# Altium schematic sheet main.SchDoc
size 420 x 297 mm; DocumentNumber: 1; SheetNumber: 1; SheetTotal: 2
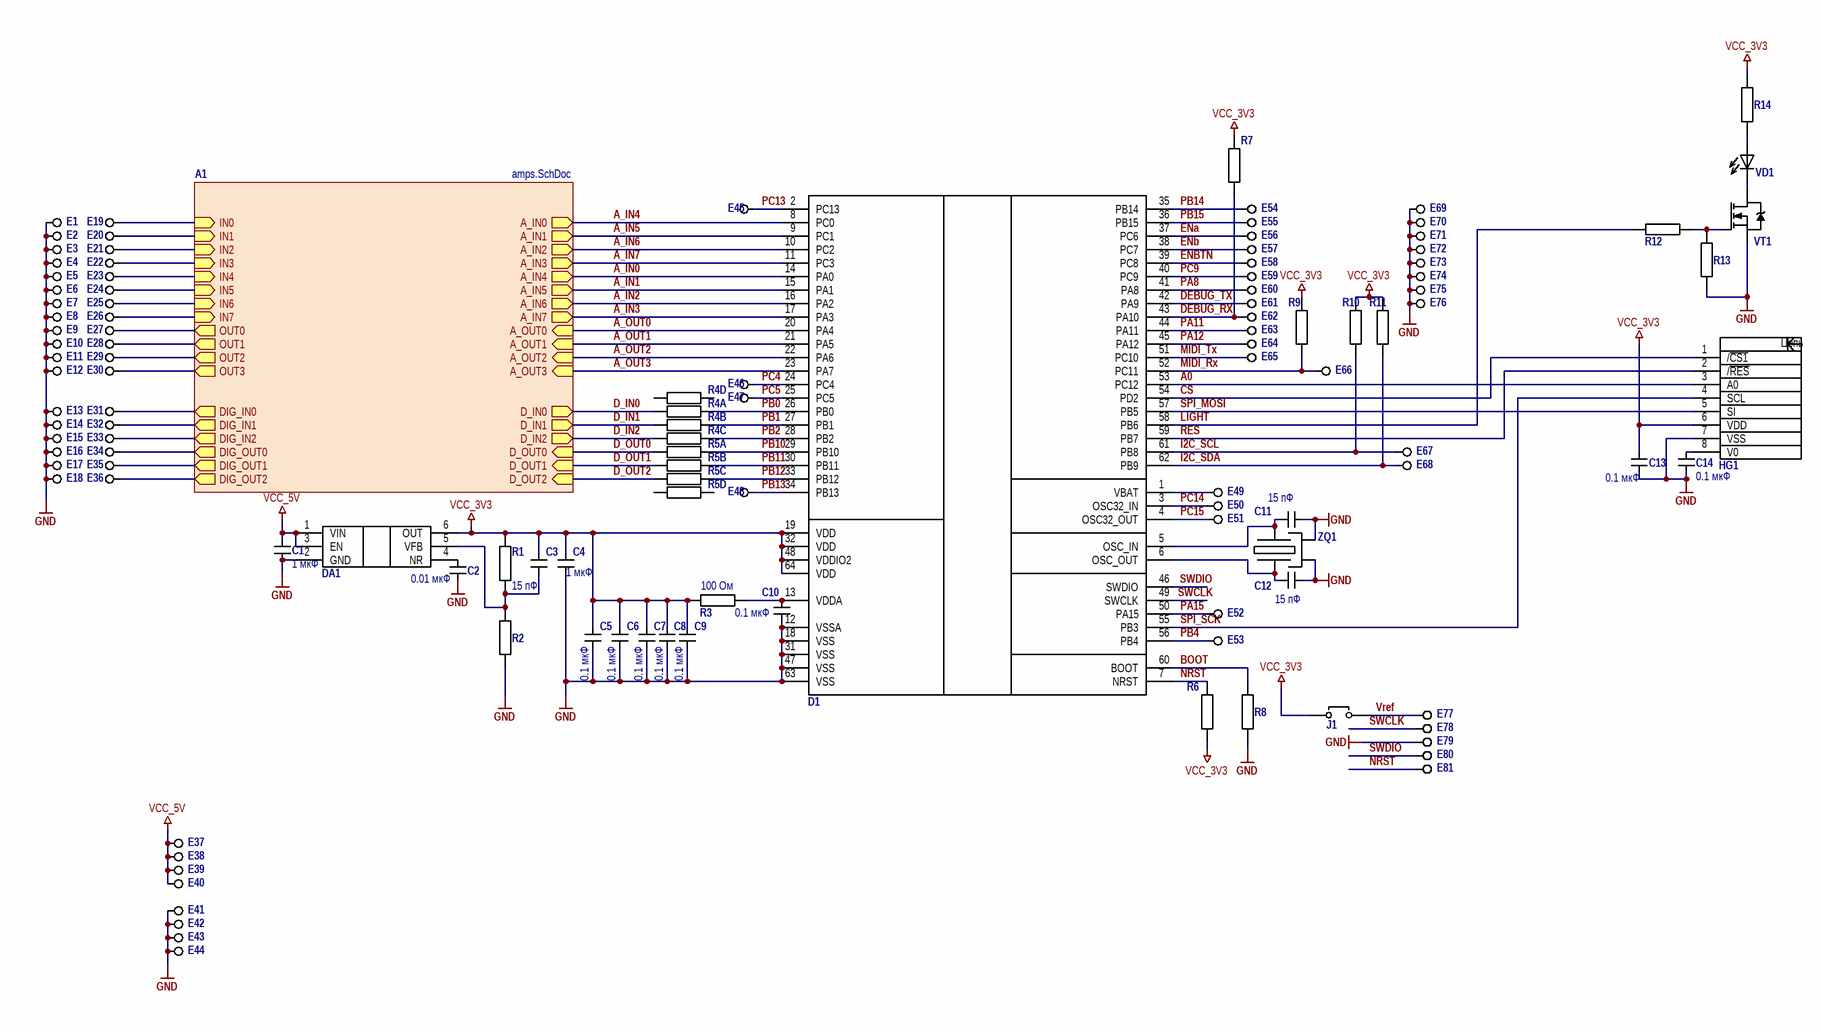
[diagram p0: main.SchDoc]

## Parts
C1  value 1 мкФ  [CAPC1608X08L]  (hidden comment: C0603_16v_1u)
C2  value 0.01 мкФ  [CAPC1608X08L]  (hidden comment: C0603_50v_0,01u)
C3  value 15 пФ  [CAPC1608X08L]  (hidden comment: C0603_50v_15p)
C4  value 1 мкФ  [CAPC1608X08L]  (hidden comment: C0603_16v_1u)
C5  value 0.1 мкФ  [CAPC1608X08L]  (hidden comment: C0603_50v_0,1u)
C6  value 0.1 мкФ  [CAPC1608X08L]  (hidden comment: C0603_50v_0,1u)
C7  value 0.1 мкФ  [CAPC1608X08L]  (hidden comment: C0603_50v_0,1u)
C8  value 0.1 мкФ  [CAPC1608X08L]  (hidden comment: C0603_50v_0,1u)
C9  value 0.1 мкФ  [CAPC1608X08L]  (hidden comment: C0603_50v_0,1u)
C10  value 0.1 мкФ  [CAPC1608X08L]  (hidden comment: C0603_50v_0,1u)
C11  value 15 пФ  [CAPC1608X08L]  (hidden comment: C0603_50v_15p)
C12  value 15 пФ  [CAPC1608X08L]  (hidden comment: C0603_50v_15p)
C13  value 0.1 мкФ  [CAPC1608X08L]  (hidden comment: C0603_50v_0,1u)
C14  value 0.1 мкФ  [CAPC1608X08L]  (hidden comment: C0603_50v_0,1u)
D1  STM32F091RB6  [TSQFP50P_10x10_64N]  (value not drawn)
DA1  TPS73001DBVT  [SOT95P280X145-6N]  (value not drawn)
E1  CON 0.9mm  [con_0.9mm]  (value not drawn)  (no BOM)
E2  CON 0.9mm  [con_0.9mm]  (value not drawn)  (no BOM)
E3  CON 0.9mm  [con_0.9mm]  (value not drawn)  (no BOM)
E4  CON 0.9mm  [con_0.9mm]  (value not drawn)  (no BOM)
E5  CON 0.9mm  [con_0.9mm]  (value not drawn)  (no BOM)
E6  CON 0.9mm  [con_0.9mm]  (value not drawn)  (no BOM)
E7  CON 0.9mm  [con_0.9mm]  (value not drawn)  (no BOM)
E8  CON 0.9mm  [con_0.9mm]  (value not drawn)  (no BOM)
E9  CON 0.9mm  [con_0.9mm]  (value not drawn)  (no BOM)
E10  CON 0.9mm  [con_0.9mm]  (value not drawn)  (no BOM)
E11  CON 0.9mm  [con_0.9mm]  (value not drawn)  (no BOM)
E12  CON 0.9mm  [con_0.9mm]  (value not drawn)  (no BOM)
E13  CON 0.9mm  [con_0.9mm]  (value not drawn)  (no BOM)
E14  CON 0.9mm  [con_0.9mm]  (value not drawn)  (no BOM)
E15  CON 0.9mm  [con_0.9mm]  (value not drawn)  (no BOM)
E16  CON 0.9mm  [con_0.9mm]  (value not drawn)  (no BOM)
E17  CON 0.9mm  [con_0.9mm]  (value not drawn)  (no BOM)
E18  CON 0.9mm  [con_0.9mm]  (value not drawn)  (no BOM)
E19  CON 0.9mm  [con_0.9mm]  (value not drawn)  (no BOM)
E20  CON 0.9mm  [con_0.9mm]  (value not drawn)  (no BOM)
E21  CON 0.9mm  [con_0.9mm]  (value not drawn)  (no BOM)
E22  CON 0.9mm  [con_0.9mm]  (value not drawn)  (no BOM)
E23  CON 0.9mm  [con_0.9mm]  (value not drawn)  (no BOM)
E24  CON 0.9mm  [con_0.9mm]  (value not drawn)  (no BOM)
E25  CON 0.9mm  [con_0.9mm]  (value not drawn)  (no BOM)
E26  CON 0.9mm  [con_0.9mm]  (value not drawn)  (no BOM)
E27  CON 0.9mm  [con_0.9mm]  (value not drawn)  (no BOM)
E28  CON 0.9mm  [con_0.9mm]  (value not drawn)  (no BOM)
E29  CON 0.9mm  [con_0.9mm]  (value not drawn)  (no BOM)
E30  CON 0.9mm  [con_0.9mm]  (value not drawn)  (no BOM)
E31  CON 0.9mm  [con_0.9mm]  (value not drawn)  (no BOM)
E32  CON 0.9mm  [con_0.9mm]  (value not drawn)  (no BOM)
E33  CON 0.9mm  [con_0.9mm]  (value not drawn)  (no BOM)
E34  CON 0.9mm  [con_0.9mm]  (value not drawn)  (no BOM)
E35  CON 0.9mm  [con_0.9mm]  (value not drawn)  (no BOM)
E36  CON 0.9mm  [con_0.9mm]  (value not drawn)  (no BOM)
E37  CON 0.9mm  [con_0.9mm]  (value not drawn)  (no BOM)
E38  CON 0.9mm  [con_0.9mm]  (value not drawn)  (no BOM)
E39  CON 0.9mm  [con_0.9mm]  (value not drawn)  (no BOM)
E40  CON 0.9mm  [con_0.9mm]  (value not drawn)  (no BOM)
E41  CON 0.9mm  [con_0.9mm]  (value not drawn)  (no BOM)
E42  CON 0.9mm  [con_0.9mm]  (value not drawn)  (no BOM)
E43  CON 0.9mm  [con_0.9mm]  (value not drawn)  (no BOM)
E44  CON 0.9mm  [con_0.9mm]  (value not drawn)  (no BOM)
E45  CON 0.9mm  [con_0.9mm]  (value not drawn)  (no BOM)
E46  CON 0.9mm  [con_0.9mm]  (value not drawn)  (no BOM)
E47  CON 0.9mm  [con_0.9mm]  (value not drawn)  (no BOM)
E48  CON 0.9mm  [con_0.9mm]  (value not drawn)  (no BOM)
E49  CON 0.9mm  [con_0.9mm]  (value not drawn)  (no BOM)
E50  CON 0.9mm  [con_0.9mm]  (value not drawn)  (no BOM)
E51  CON 0.9mm  [con_0.9mm]  (value not drawn)  (no BOM)
E52  CON 0.9mm  [con_0.9mm]  (value not drawn)  (no BOM)
E53  CON 0.9mm  [con_0.9mm]  (value not drawn)  (no BOM)
E54  CON 0.9mm  [con_0.9mm]  (value not drawn)  (no BOM)
E55  CON 0.9mm  [con_0.9mm]  (value not drawn)  (no BOM)
E56  CON 0.9mm  [con_0.9mm]  (value not drawn)  (no BOM)
E57  CON 0.9mm  [con_0.9mm]  (value not drawn)  (no BOM)
E58  CON 0.9mm  [con_0.9mm]  (value not drawn)  (no BOM)
E59  CON 0.9mm  [con_0.9mm]  (value not drawn)  (no BOM)
E60  CON 0.9mm  [con_0.9mm]  (value not drawn)  (no BOM)
E61  CON 0.9mm  [con_0.9mm]  (value not drawn)  (no BOM)
E62  CON 0.9mm  [con_0.9mm]  (value not drawn)  (no BOM)
E63  CON 0.9mm  [con_0.9mm]  (value not drawn)  (no BOM)
E64  CON 0.9mm  [con_0.9mm]  (value not drawn)  (no BOM)
E65  CON 0.9mm  [con_0.9mm]  (value not drawn)  (no BOM)
E66  CON 0.9mm  [con_0.9mm]  (value not drawn)  (no BOM)
E67  CON 0.9mm  [con_0.9mm]  (value not drawn)  (no BOM)
E68  CON 0.9mm  [con_0.9mm]  (value not drawn)  (no BOM)
E69  CON 0.9mm  [con_0.9mm]  (value not drawn)  (no BOM)
E70  CON 0.9mm  [con_0.9mm]  (value not drawn)  (no BOM)
E71  CON 0.9mm  [con_0.9mm]  (value not drawn)  (no BOM)
E72  CON 0.9mm  [con_0.9mm]  (value not drawn)  (no BOM)
E73  CON 0.9mm  [con_0.9mm]  (value not drawn)  (no BOM)
E74  CON 0.9mm  [con_0.9mm]  (value not drawn)  (no BOM)
E75  CON 0.9mm  [con_0.9mm]  (value not drawn)  (no BOM)
E76  CON 0.9mm  [con_0.9mm]  (value not drawn)  (no BOM)
E77  CON 0.9mm  [con_0.9mm]  (value not drawn)  (no BOM)
E78  CON 0.9mm  [con_0.9mm]  (value not drawn)  (no BOM)
E79  CON 0.9mm  [con_0.9mm]  (value not drawn)  (no BOM)
E80  CON 0.9mm  [con_0.9mm]  (value not drawn)  (no BOM)
E81  CON 0.9mm  [con_0.9mm]  (value not drawn)  (no BOM)
HG1  MT-12864  [MT-12864]  (value not drawn)
J1  Jumper_1x1  [jumper 1x1]  (value not drawn)  (no BOM)
R1  RES0603_51k  [RESC1608X04N]  (value not drawn)
R2  RES0603_30k±1%  [RESC1608X04N]  (value not drawn)
R3  value 100 Ом  [RESC1608X04N]  (hidden comment: RES0603_100r)
R4  CAT16-470J4  [CAC-80P320X160-8N]  (value not drawn)  (parts A,B,C,D of 4)
R5  CAT16-470J4  [CAC-80P320X160-8N]  (value not drawn)  (parts A,B,C,D of 4)
R6  RES0603_10k  [RESC1608X04N]  (value not drawn)
R7  RES0603_10k  [RESC1608X04N]  (value not drawn)
R8  RES0603_10k  [RESC1608X04N]  (value not drawn)
R9  RES0603_10k  [RESC1608X04N]  (value not drawn)
R10  RES0603_10k  [RESC1608X04N]  (value not drawn)
R11  RES0603_10k  [RESC1608X04N]  (value not drawn)
R12  RES0603_47R  [RESC1608X04N]  (value not drawn)
R13  RES0603_10k  [RESC1608X04N]  (value not drawn)
R14  RES0603_47R  [RESC1608X04N]  (value not drawn)
VD1  S11-161A-5W  [S11-161A-5W]  (value not drawn)
VT1  IRLML2402  [SOT95P245X110-3N]  (value not drawn)
ZQ1  TX3 12.0000 MHZ  [CDFN/DFN]  (value not drawn)

## Sub-sheets
A1 = amps.SchDoc: A_IN0 (out), A_IN1 (out), A_IN2 (out), A_IN3 (out), IN0 (in), IN1 (in), IN2 (in), IN3 (in), A_IN4 (out), IN4 (in), A_IN5 (out), IN5 (in), A_IN6 (out), IN6 (in), A_IN7 (out), IN7 (in), A_OUT0 (in), OUT0 (out), A_OUT1 (in), OUT1 (out), A_OUT2 (in), OUT2 (out), A_OUT3 (in), OUT3 (out), DIG_IN0 (out), D_IN0 (out), DIG_IN1 (out), D_IN1 (out), DIG_IN2 (out), D_IN2 (out), DIG_OUT2 (out), D_OUT2 (in), DIG_OUT1 (out), D_OUT1 (in), DIG_OUT0 (out), D_OUT0 (in)

## Nets
GND: C1.1 C2.1 C4.1 C5.1 C6.1 C7.1 C8.1 C9.1 C10.1 C11.2 C12.2 C13.1 C14.1 D1.12(VSSA) D1.18(VSS) D1.31(VSS) D1.47(VSS) D1.63(VSS) DA1.2(GND) E1.1 E2.1 E3.1 E4.1 E5.1 E6.1 E7.1 E8.1 E9.1 E10.1 E11.1 E12.1 E13.1 E14.1 E15.1 E16.1 E17.1 E18.1 E41.1 E42.1 E43.1 E44.1 E69.1 E70.1 E71.1 E72.1 E73.1 E74.1 E75.1 E76.1 E79.1 HG1.7(VSS) R2.1 R8.1 R13.1 VT1.2(Source) ZQ1.2 ZQ1.4
VCC_3V3: C3.2 C4.2 C5.2 C6.2 C7.2 C8.2 C9.2 C13.2 D1.19(VDD) D1.32(VDD) D1.48(VDDIO2) D1.64(VDD) DA1.6(OUT) HG1.6(VDD) J1.1 R1.2 R3.1 R6.1 R7.2 R9.2 R10.2 R11.2 R14.2
VCC_5V: C1.2 DA1.1(VIN) DA1.3(EN) E37.1 E38.1 E39.1 E40.1
A0: D1.53(PC12) HG1.3(A0)
A_IN0: D1.14(PA0) ; sheet A1/A_IN4
A_IN1: D1.15(PA1) ; sheet A1/A_IN5
A_IN2: D1.16(PA2) ; sheet A1/A_IN6
A_IN3: D1.17(PA3) ; sheet A1/A_IN7
A_IN4: D1.8(PC0) ; sheet A1/A_IN0
A_IN5: D1.9(PC1) ; sheet A1/A_IN1
A_IN6: D1.10(PC2) ; sheet A1/A_IN2
A_IN7: D1.11(PC3) ; sheet A1/A_IN3
A_OUT0: D1.20(PA4) ; sheet A1/A_OUT0
A_OUT1: D1.21(PA5) ; sheet A1/A_OUT1
A_OUT2: D1.22(PA6) ; sheet A1/A_OUT2
A_OUT3: D1.23(PA7) ; sheet A1/A_OUT3
BOOT: D1.60(BOOT) R8.2
~{CS}: D1.54(PD2) HG1.1(/~{CS1})
D_IN0: R4.1 ; sheet A1/D_IN0
D_IN1: R4.2 ; sheet A1/D_IN1
D_IN2: R4.3 ; sheet A1/D_IN2
D_OUT0: R5.1 ; sheet A1/D_OUT0
D_OUT1: R5.2 ; sheet A1/D_OUT1
D_OUT2: R5.3 ; sheet A1/D_OUT2
DEBUG_RX: D1.43(PA10) E62.1 R7.1
DEBUG_TX: D1.42(PA9) E61.1
ENa: D1.37(PC6) E56.1
ENb: D1.38(PC7) E57.1
ENBTN: D1.39(PC8) E58.1
I2C_SCL: D1.61(PB8) E67.1 R10.1
I2C_SDA: D1.62(PB9) E68.1 R11.1
LIGHT: D1.58(PB6) R12.2
MIDI_Rx: D1.52(PC11) E66.1 R9.1
MIDI_Tx: D1.51(PC10) E65.1
NRST: D1.7(NRST) E81.1 R6.2
PA8: D1.41(PA8) E60.1
PA11: D1.44(PA11) E63.1
PA12: D1.45(PA12) E64.1
PA15: D1.50(PA15) E52.1
PB0: D1.26(PB0) R4.8
PB1: D1.27(PB1) R4.7
PB2: D1.28(PB2) R4.6
PB4: D1.56(PB4) E53.1
PB10: D1.29(PB10) R5.8
PB11: D1.30(PB11) R5.7
PB12: D1.33(PB12) R5.6
PB13: D1.34(PB13) E48.1
PB14: D1.35(PB14) E54.1
PB15: D1.36(PB15) E55.1
PC9: D1.40(PC9) E59.1
PC13: D1.2(PC13) E45.1
PC14: D1.3(OSC32_IN) E50.1
PC15: D1.4(OSC32_OUT) E51.1
PС4: D1.24(PC4) E46.1
PС5: D1.25(PC5) E47.1
~{RES}: D1.59(PB7) HG1.2(/~{RES})
SPI_MOSI: D1.57(PB5) HG1.5(SI)
SPI_SCK: D1.55(PB3) HG1.4(SCL)
SWCLK: D1.49(SWCLK) E78.1
SWDIO: D1.46(SWDIO) E80.1
Vref: E77.1 J1.2
NetC2_2: C2.2 DA1.4(NR)
NetC3_1: C3.1 DA1.5(VFB) R1.1 R2.2
NetC10_2: C10.2 D1.13(VDDA) R3.2
NetC11_1: C11.1 D1.5(OSC_IN) ZQ1.3
NetC12_1: C12.1 D1.6(OSC_OUT) ZQ1.1
NetC14_2: C14.2 HG1.8(V0)
NetD1_1: D1.1(VBAT) E49.1
NetE19_1: E19.1 ; sheet A1/IN0
NetE20_1: E20.1 ; sheet A1/IN1
NetE21_1: E21.1 ; sheet A1/IN2
NetE22_1: E22.1 ; sheet A1/IN3
NetE23_1: E23.1 ; sheet A1/IN4
NetE24_1: E24.1 ; sheet A1/IN5
NetE25_1: E25.1 ; sheet A1/IN6
NetE26_1: E26.1 ; sheet A1/IN7
NetE27_1: E27.1 ; sheet A1/OUT0
NetE28_1: E28.1 ; sheet A1/OUT1
NetE29_1: E29.1 ; sheet A1/OUT2
NetE30_1: E30.1 ; sheet A1/OUT3
NetE31_1: E31.1 ; sheet A1/DIG_IN0
NetE32_1: E32.1 ; sheet A1/DIG_IN1
NetE33_1: E33.1 ; sheet A1/DIG_IN2
NetE34_1: E34.1 ; sheet A1/DIG_OUT0
NetE35_1: E35.1 ; sheet A1/DIG_OUT1
NetE36_1: E36.1 ; sheet A1/DIG_OUT2
NetR12_1: R12.1 R13.2 VT1.1(Gate)
NetR14_1: R14.1 VD1.2(A)
NetVD1_1: VD1.1(K) VT1.3(Drain)

Not connected (* = marked no-connect by the designer): R4 4 5; R5 4 5

## Notes on the sheet
- Версия
- Перв. примен.
- Справ. №
- Подп. дата
- Инв. № дубл.
- Взам. инв. №
- Подп. и дата
- Изм.
- Разраб.
- Лист
- № докум.
- Подп.
- Дата
- Лит.
- Масса
- Масштаб
- Пров.
- Т.контр.
- Листов
- Инв. № подл.
- Н.контр.
- Утв.
- ALTIUM GOSTBOM2.0 KEV
- Файл:
- Копировал
- Формат А3
- (in symbol CMP-00308-1) Цепь

## Library data of the parts
C1 C4 = CMP-001-00002-10: Чип 0603 16в 1мкФ; Bom_name: ЧИП-0603-X7R-16 В-1 мкФ ±10%; dopusk: ±10%; d_type: X7R; planar: 1; temp_range: -55...+155; PlaceALL_name: 0603-X7R-1u; PlaceALL_value: 1u; Type: 0603; napr: 16 В
C2 = CMP-00023-7: Чип 0603 50в 0,01мкФ; Bom_name: ЧИП-0603-X7R-50 В-0.01 мкФ ±10%; dopusk: ±10%; d_type: X7R; planar: 1; temp_range: -55...+155; PlaceALL_name: 0603-X7R-0.01u; PlaceALL_value: 0.01u; Type: 0603; napr: 50 В
C3 C11 C12 = CMP-00114-2: Чип 0603 50в 15 пФ; Bom_name: ЧИП-0603-NP0-50 В-15 пФ ±5%; dopusk: ±5%; d_type: NP0; PlaceALL_name: 0603-NP0-15p; PlaceALL_value: 15p; planar: 1; temp_range: -55...+155; Type: 0603; napr: 50 В
C5-C10 C13 C14 = CMP-001-00000-11: Чип 0603 50в 0,1мкФ; Bom_name: ЧИП-0603-X7R-50 В-0.1 мкФ ±10%; dopusk: ±10%; d_type: X7R; planar: 1; temp_range: -55...+155; PlaceALL_name: 0603-X7R-0.1u; PlaceALL_value: 0.1u; Type: 0603; napr: 50 В
D1 = CMP-020-00004-4: ARM®-based 32-bit MCU, up to 256 KB Flash; planar: 1; temp_range: -40…+150; Bom_name: STM32F091RB6; PlaceALL_name: =Name
DA1 = TPS73001: TPS730 Low-Noise, High PSRR, RF, 200-mA Low-Dropout Linear Regulators; name: TPS73001DBVT; type: Микросхемы
E1-E81 = CMP-00028-00014-2: Контакт 0,9мм
HG1 = CMP-00308-1: LCD индикатор MT-12864; planar: 1; temp_range: -20…+70; Bom_name: MT-12864; PlaceALL_name: =Name
J1 = CMP-00028-00000-7: Перемычка под пайку 1мм
R1 = CMP-00183-1: Чип 0603 51 кОм; Bom_name: ЧИП-0603 -51 кОм ±5%; dopusk: ±5%; PlaceALL_name: 0603-51k; PlaceALL_value: 51k; planar: 1; temp_range: -55...+155; value: 51 кОм; Type: 0603
R2 = CMP-00131-1: Чип 0603 30 кОм; Bom_name: ЧИП-0603 -30 кОм ±1%; dopusk: ±1%; PlaceALL_name: 0603-30k ±1%; PlaceALL_value: 30k; planar: 1; temp_range: -55...+155; value: 30 кОм; PlaceALL_dopusk: ±1%; Type: 0603
R3 = CMP-00024-9: Чип 0603 100 Ом; Bom_name: ЧИП-0603 -100 Ом ±5%; dopusk: ±5%; planar: 1; temp_range: -55...+155; PlaceALL_name: 0603-100r; PlaceALL_value: 100r; Type: 0603
R4 R5 = CMP-00001-8: Сборка 47 Ом; value: 47 Ом; dopusk: ±5%; planar: 1; temp_range: -55...+155; Bom_name: CAT16-470J4; PlaceALL_name: CAT16-470J4
R6-R11 R13 = CMP-00004-13: Чип 0603 10 кОм; Bom_name: ЧИП-0603 -10 кОм ±5%; dopusk: ±5%; planar: 1; value: 10 кОм; temp_range: -55...+155; PlaceALL_name: 0603-10k; PlaceALL_value: 10k; Type: 0603
R12 R14 = CMP-00003-13: Чип 0603 47 Ом; Bom_name: ЧИП-0603 -47 Ом ±5%; dopusk: ±5%; planar: 1; value: 47 Ом; temp_range: -55...+155; PlaceALL_name: 0603-47r; PlaceALL_value: 47r; Type: 0603
VD1 = CMP-00309-2: Светодиод зелёный 5mm; Bom_name: Светодиод S11-161A-5W; planar: 1; temp_range: -65...+175; PlaceALL_name: =Name
VT1 = CMP-00035-2: sot-23 HEXFET MOSFET; Bom_name: Транзистор IRLML2402TR; planar: 1; temp_range: -55…+150; PlaceALL_name: =Name
ZQ1 = CMP-003-00004-4: Кварцевый резонатор 12 МГц; Bom_name: Резонатор кварцевый TX3 12.0000 MHz; planar: 1; temp_range: -20…+70; PlaceALL_name: TX3 12.0000 MHZ